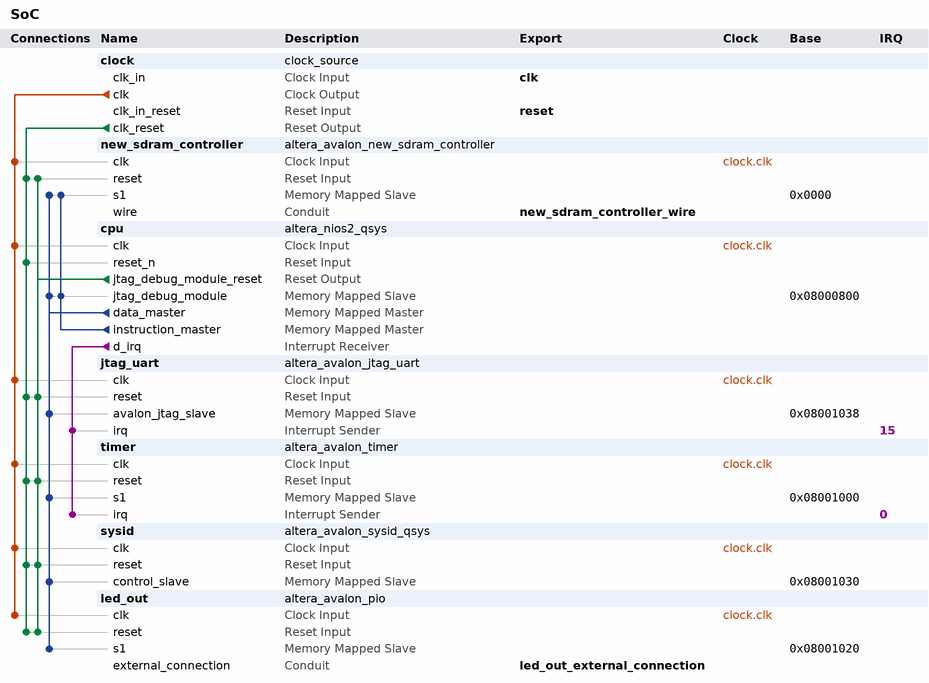
[diagram p0: system contents]
# Platform Designer (Qsys) system SoC, Cyclone IV E EP4CE115F29C7
# Parameters at their usual value, and those the tool derives, are not listed.
package require -exact qsys 13.1
create_system SoC
set_project_property DEVICE_FAMILY {Cyclone IV E}
set_project_property DEVICE EP4CE115F29C7

add_instance clock clock_source 13.1
set_instance_parameter_value clock clockFrequency 50000000

add_instance new_sdram_controller altera_avalon_new_sdram_controller 13.1
set_instance_parameter_value new_sdram_controller TAC 5.5
set_instance_parameter_value new_sdram_controller TRCD 20.0
set_instance_parameter_value new_sdram_controller TRP 20.0
set_instance_parameter_value new_sdram_controller casLatency 3
set_instance_parameter_value new_sdram_controller columnWidth 10
set_instance_parameter_value new_sdram_controller dataWidth 32
set_instance_parameter_value new_sdram_controller generateSimulationModel false
set_instance_parameter_value new_sdram_controller model single_Micron_MT48LC4M32B2_7_chip
set_instance_parameter_value new_sdram_controller numberOfBanks 4
set_instance_parameter_value new_sdram_controller numberOfChipSelects 1
set_instance_parameter_value new_sdram_controller powerUpDelay 100.0
set_instance_parameter_value new_sdram_controller refreshPeriod 15.625
set_instance_parameter_value new_sdram_controller rowWidth 13

add_instance cpu altera_nios2_qsys 13.1
set_instance_parameter_value cpu resetSlave new_sdram_controller.s1
set_instance_parameter_value cpu mmu_TLBMissExcSlave None
set_instance_parameter_value cpu exceptionSlave new_sdram_controller.s1
set_instance_parameter_value cpu breakSlave cpu.jtag_debug_module
set_instance_parameter_value cpu impl Tiny
set_instance_parameter_value cpu icache_size 4096

add_instance jtag_uart altera_avalon_jtag_uart 13.1
set_instance_parameter_value jtag_uart simInteractiveOptions NO_INTERACTIVE_WINDOWS

add_instance timer altera_avalon_timer 13.1
set_instance_parameter_value timer period 1
set_instance_parameter_value timer periodUnits MSEC

add_instance sysid altera_avalon_sysid_qsys 13.1
set_instance_parameter_value sysid id 134221872

add_instance led_out altera_avalon_pio 13.1
set_instance_parameter_value led_out direction Output
set_instance_parameter_value led_out width 8

# connections
add_connection clock.clk cpu.clk clock
add_connection clock.clk jtag_uart.clk clock
add_connection clock.clk led_out.clk clock
add_connection clock.clk new_sdram_controller.clk clock
add_connection clock.clk sysid.clk clock
add_connection clock.clk timer.clk clock
add_connection clock.clk_reset cpu.reset_n reset
add_connection clock.clk_reset jtag_uart.reset reset
add_connection clock.clk_reset led_out.reset reset
add_connection clock.clk_reset new_sdram_controller.reset reset
add_connection clock.clk_reset sysid.reset reset
add_connection clock.clk_reset timer.reset reset
add_connection cpu.jtag_debug_module_reset jtag_uart.reset reset
add_connection cpu.jtag_debug_module_reset led_out.reset reset
add_connection cpu.jtag_debug_module_reset new_sdram_controller.reset reset
add_connection cpu.jtag_debug_module_reset sysid.reset reset
add_connection cpu.jtag_debug_module_reset timer.reset reset
add_connection cpu.data_master cpu.jtag_debug_module avalon
set_connection_parameter_value cpu.data_master/cpu.jtag_debug_module baseAddress 0x08000800
add_connection cpu.data_master jtag_uart.avalon_jtag_slave avalon
set_connection_parameter_value cpu.data_master/jtag_uart.avalon_jtag_slave baseAddress 0x08001038
add_connection cpu.data_master led_out.s1 avalon
set_connection_parameter_value cpu.data_master/led_out.s1 baseAddress 0x08001020
add_connection cpu.data_master new_sdram_controller.s1 avalon
set_connection_parameter_value cpu.data_master/new_sdram_controller.s1 baseAddress 0x0000
add_connection cpu.data_master sysid.control_slave avalon
set_connection_parameter_value cpu.data_master/sysid.control_slave baseAddress 0x08001030
add_connection cpu.data_master timer.s1 avalon
set_connection_parameter_value cpu.data_master/timer.s1 baseAddress 0x08001000
add_connection cpu.instruction_master cpu.jtag_debug_module avalon
set_connection_parameter_value cpu.instruction_master/cpu.jtag_debug_module baseAddress 0x08000800
add_connection cpu.instruction_master new_sdram_controller.s1 avalon
set_connection_parameter_value cpu.instruction_master/new_sdram_controller.s1 baseAddress 0x0000
add_connection cpu.d_irq jtag_uart.irq interrupt
set_connection_parameter_value cpu.d_irq/jtag_uart.irq irqNumber 15
add_connection cpu.d_irq timer.irq interrupt
set_connection_parameter_value cpu.d_irq/timer.irq irqNumber 0

# exported interfaces
add_interface clk clock sink
set_interface_property clk EXPORT_OF clock.clk_in
add_interface reset reset sink
set_interface_property reset EXPORT_OF clock.clk_in_reset
add_interface new_sdram_controller_wire conduit end
set_interface_property new_sdram_controller_wire EXPORT_OF new_sdram_controller.wire
add_interface led_out_external_connection conduit end
set_interface_property led_out_external_connection EXPORT_OF led_out.external_connection

set_interconnect_requirement {$system} qsys_mm.clockCrossingAdapter HANDSHAKE
set_interconnect_requirement {$system} qsys_mm.maxAdditionalLatency 1
set_interconnect_requirement {$system} qsys_mm.insertDefaultSlave false

save_system SoC.qsys
